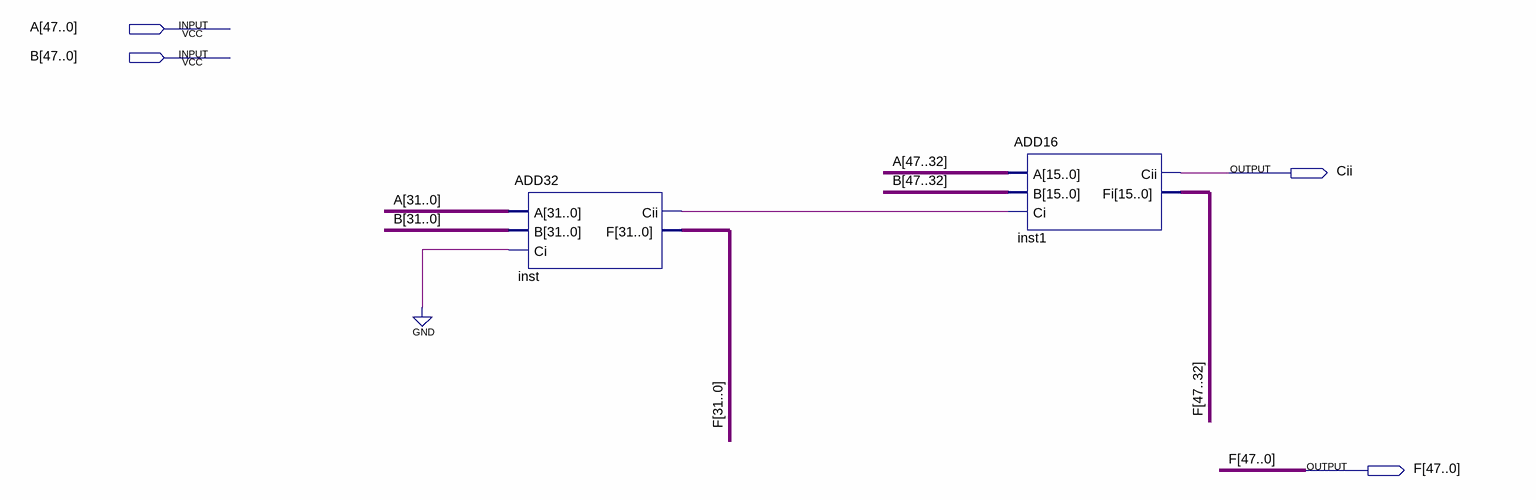
[diagram p0: schematic sheet]
// Quartus schematic ADD48.bdf as structural Verilog: 2 symbols, 4 pins
module ADD48 (
  input  [47:0] A,
  input  [47:0] B,
  output Cii,
  output [47:0] F
);

  wire inst_cii;

  ADD32 inst (.A(A[31:0]), .B(B[31:0]), .Ci(1'b0), .Cii(inst_cii), .F(F[31:0]));
  ADD16 inst1 (.A(A[47:32]), .B(B[47:32]), .Ci(inst_cii), .Cii(Cii), .Fi(F[47:32]));
endmodule
